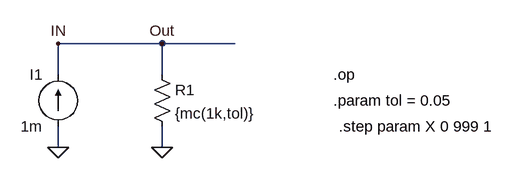
[diagram p0: schematic 蒙特卡洛分析_电阻容差变化对电路的影响输出的影响.asc]
蒙特卡洛分析_电阻容差变化对电路的影响输出的影响.asc, the LTspice schematic file:
Version 4.1
SHEET 1 880 680
WIRE 320 80 160 80
WIRE 432 80 320 80
WIRE 160 128 160 80
WIRE 320 128 320 80
WIRE 160 240 160 208
WIRE 320 240 320 208
FLAG 160 240 0
FLAG 160 80 IN
FLAG 320 80 Out
FLAG 320 240 0
SYMBOL res 304 112 R0
SYMATTR InstName R1
SYMATTR Value {mc(1k,tol)}
SYMBOL current 160 208 R180
WINDOW 0 24 80 Left 2
WINDOW 3 24 0 Left 2
WINDOW 123 0 0 Left 0
WINDOW 39 0 0 Left 0
SYMATTR InstName I1
SYMATTR Value 1m
TEXT 584 168 Left 2 !.param tol = 0.05
TEXT 584 128 Left 2 !.op
TEXT 592 208 Left 2 !.step param X 0 999 1

The netlist it stands for:
* 蒙特卡洛分析_电阻容差变化对电路的影响输出的影响.asc
R1 Out 0 {mc(1k,tol)}
I1 0 Out 1m
.param tol = 0.05
.op
.step param X 0 999 1
.backanno
.end